# EAGLE design schematic (EAGLE 9.0.0)
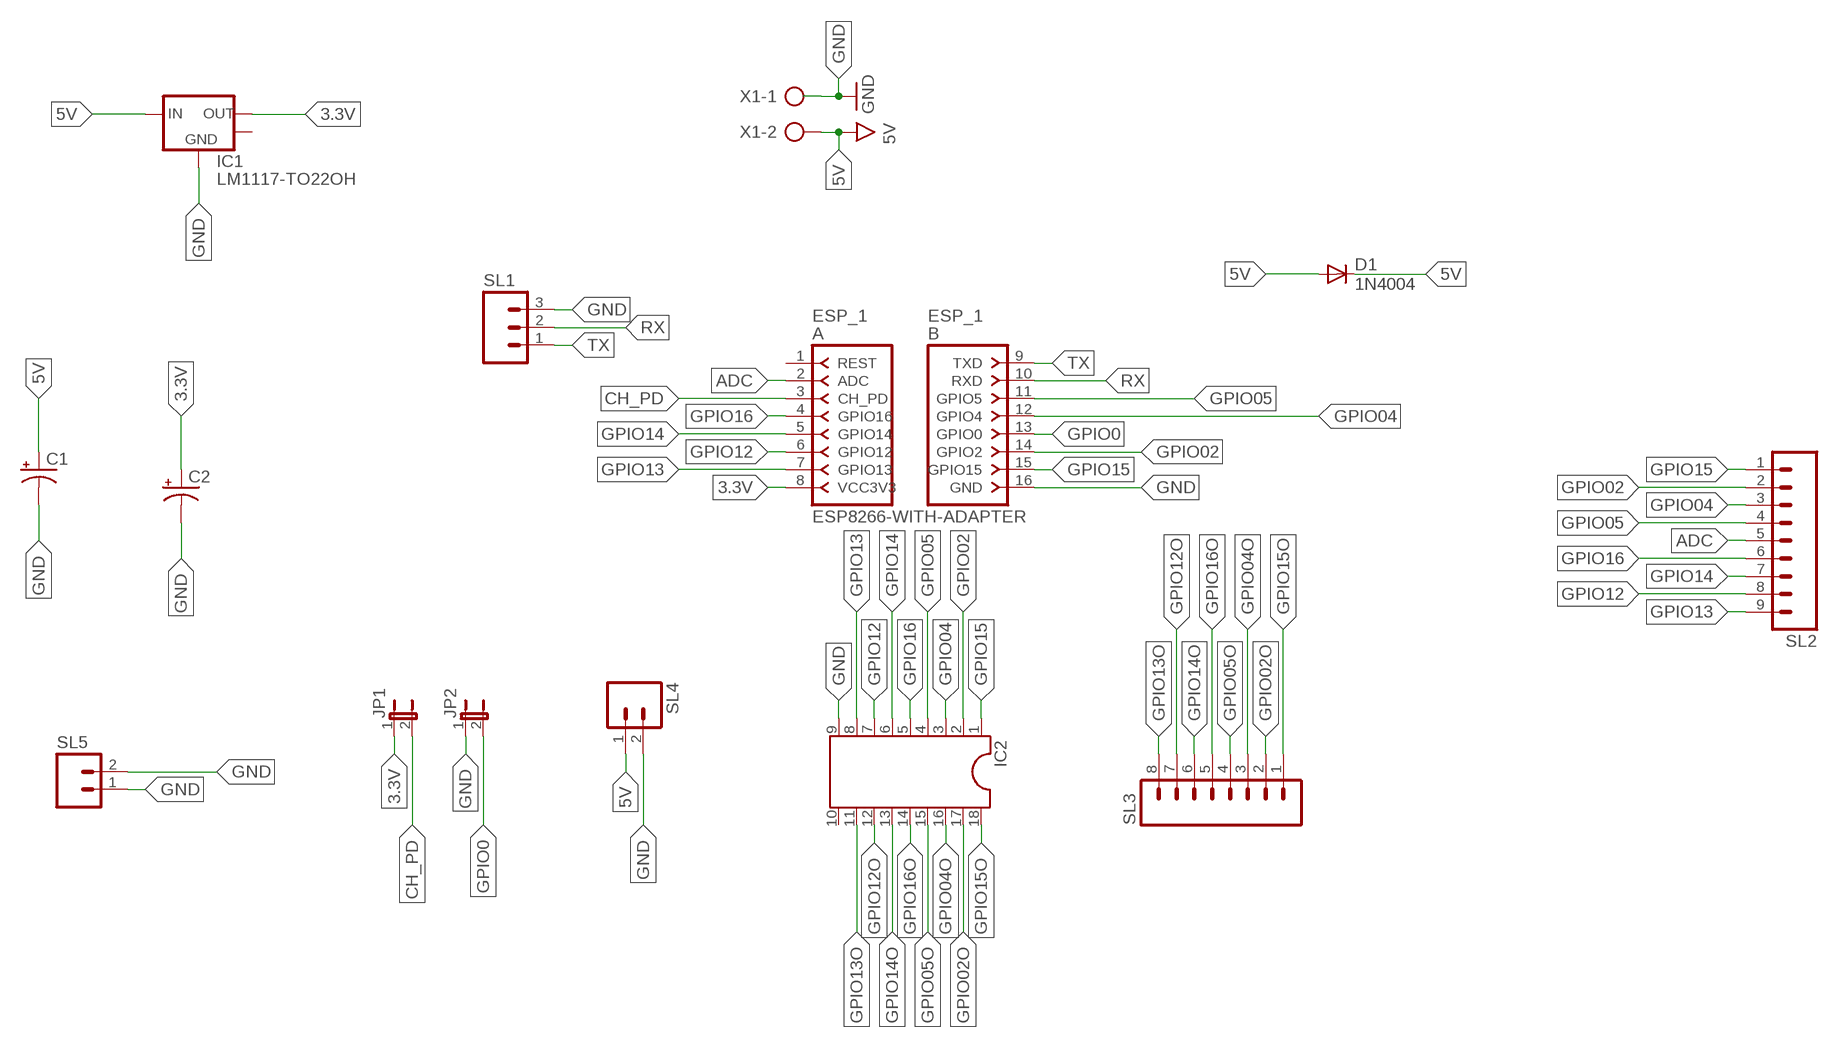
[diagram p0: schematic, sheet 1]

## Parts
C1  CPOL-USE2-4  [E2-4]
C2  CPOL-USE2-4  [E2-4]
D1  1N4004  [DO41-10]
ESP_1  ESP8266-WITH-ADAPTER  [ESP8266-ADAPTER]
IC1  LM1117-TO22OH  [TO220L1]
IC2  DIL18  [DIL18]
JP1  JP1E  [JP1]
JP2  JP1E  [JP1]
SL1  M03  [03P]
SL2  M09  [09P]
SL3  M08  [08P]
SL4  M02  [02P]
SL5  M02  [02P]
X1  AK500/2-H  [AK500/2-H]

## Nets
3.3V: C2.+ ESP_1.8(VCC3V3) IC1.2(VOUT) JP1.1
5V: C1.+ D1.A D1.C IC1.3(VIN) SL4.1 X1.2
ADC: ESP_1.2(ADC) SL2.5
CH_PD: ESP_1.3(CH_PD) JP1.2
GND: C1.- C2.- ESP_1.16(GND) IC1.1(GND) IC2.9 JP2.1 SL1.3 SL4.2 SL5.1 SL5.2 X1.1
GPIO0: ESP_1.13(GPIO0) JP2.2
GPIO02: ESP_1.14(GPIO2) IC2.2 SL2.2
GPIO02O: IC2.17 SL3.2
GPIO04: ESP_1.12(GPIO4) IC2.3 SL2.3
GPIO04O: IC2.16 SL3.3
GPIO05: ESP_1.11(GPIO5) IC2.4 SL2.4
GPIO05O: IC2.15 SL3.4
GPIO12: ESP_1.6(GPIO12) IC2.7 SL2.8
GPIO12O: IC2.12 SL3.7
GPIO13: ESP_1.7(GPIO13) IC2.8 SL2.9
GPIO13O: IC2.11 SL3.8
GPIO14: ESP_1.5(GPIO14) IC2.6 SL2.7
GPIO14O: IC2.13 SL3.6
GPIO15: ESP_1.15(GPIO15) IC2.1 SL2.1
GPIO15O: IC2.18 SL3.1
GPIO16: ESP_1.4(GPIO16) IC2.5 SL2.6
GPIO16O: IC2.14 SL3.5
RX: ESP_1.10(RXD) SL1.2
TX: ESP_1.9(TXD) SL1.1
Unconnected: ESP_1.1(REST) IC1.4(HEATSINK) IC2.10

## Library data of the parts
C1 C2 = adafruit:CPOL-US: POLARIZED CAPACITOR, American symbol
D1 = adafruit:1N4004: DIODE General purpose 1N400x type rectifier (With bigger pads) http://www.ladyada.net/library/pcb/eaglelibrary.html
ESP_1 = esp8266_with_adapter:ESP8266-WITH-ADAPTER: ESP8266 Adapter for ESP8266-03, ESP8266-04, ESP8266-07, ESP8266-08, ESP8266-12 and similar. (c) by Bartosz Batorek obi--wan@wp.pl
IC1 = bt_regulator:LM1117: LDO Voltage Regulator NCP1117 series are low dropout positive voltage regulators that are capable of providing an output current that is in excess of 1.0 A with a maximum dropout voltage of 1.2 V at 800 mA over temperature. This series contains nine fixed output voltages of 1.5 V, 1.8 V, 1.9 V, 2.0 V, 2.5 V, 2.85 V, 3.3 V, 5.0 V, and 12 V that have no minimum load requirement to maintain regulation. Also included is an adjustable output version that can be programmed from 1.25 V to 18.8 V with two external resistors. datasheet.pdf <http://www.onsemi.com/pub_link/Collateral/NCP1117-D.PDF> LM1117-N is a series of low dropout voltage regulators of 1.2V at 800mA of load current. It has the same pin-out as Texas Instruments' industry standard LM317. The LM1117-N is available in an adjustable version, available in five fixed voltages, 1.8V, 2.5V, 2.85V, 3.3V, and 5V. The LM1117-N offers current limiting and thermal shutdown. Its circuit includes a zener trimmed to within ±1%. datasheet.pdf <http://www.ti.com/lit/ds/symlink/lm1117-n.pdf>
IC2 = ic-package:DIL18: Dual In Line / Socket
JP1 JP2 = jumper:JP1E: JUMPER
SL1 = con-amp-quick:M03: AMP QUICK CONNECTOR; OC_FARNELL: unknown; OC_NEWARK: unknown
SL2 = con-amp-quick:M09: AMP QUICK CONNECTOR; OC_FARNELL: unknown; OC_NEWARK: unknown
SL3 = con-amp-quick:M08: AMP QUICK CONNECTOR; OC_FARNELL: unknown; OC_NEWARK: unknown
SL4 SL5 = con-amp-quick:M02: AMP QUICK CONNECTOR; OC_FARNELL: unknown; OC_NEWARK: unknown
X1 = con-ptr500:AK500/2-H: CONNECTOR Aug. 2004 / PTR Meßtechnik: Die Bezeichnung der Serie AK505 wurde geändert. Es handelt sich hierbei um AK500 in horizontaler Ausführung.; OC_FARNELL: unknown; OC_NEWARK: unknown

## Board
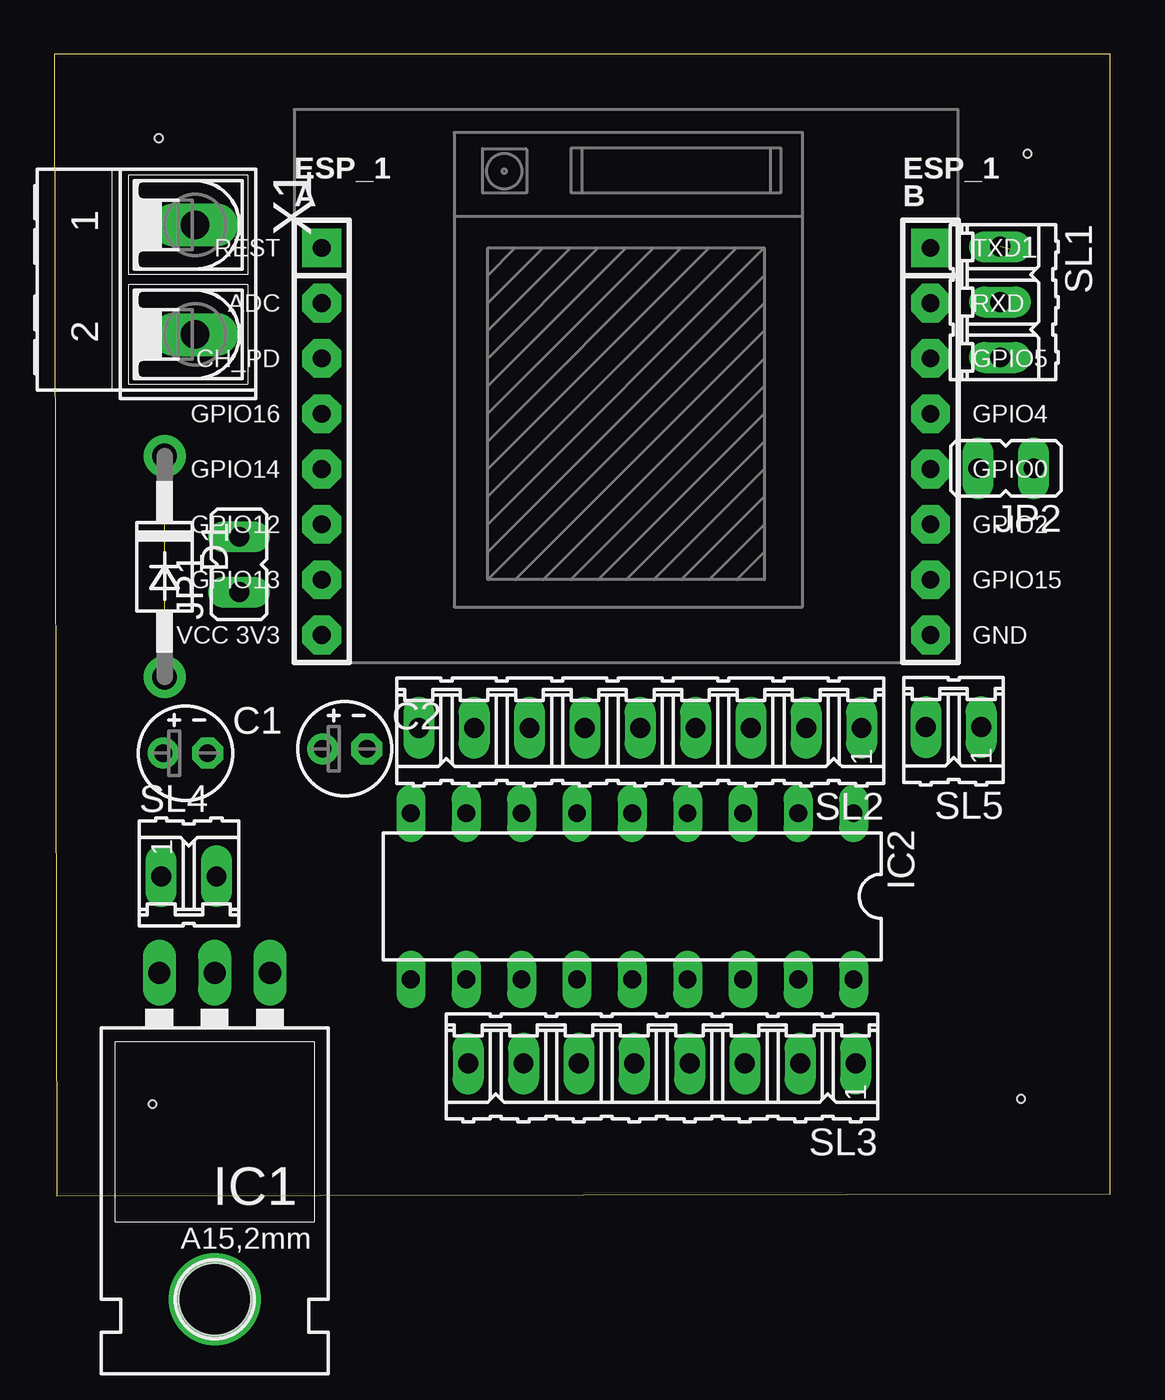
[diagram p1: board, top side]
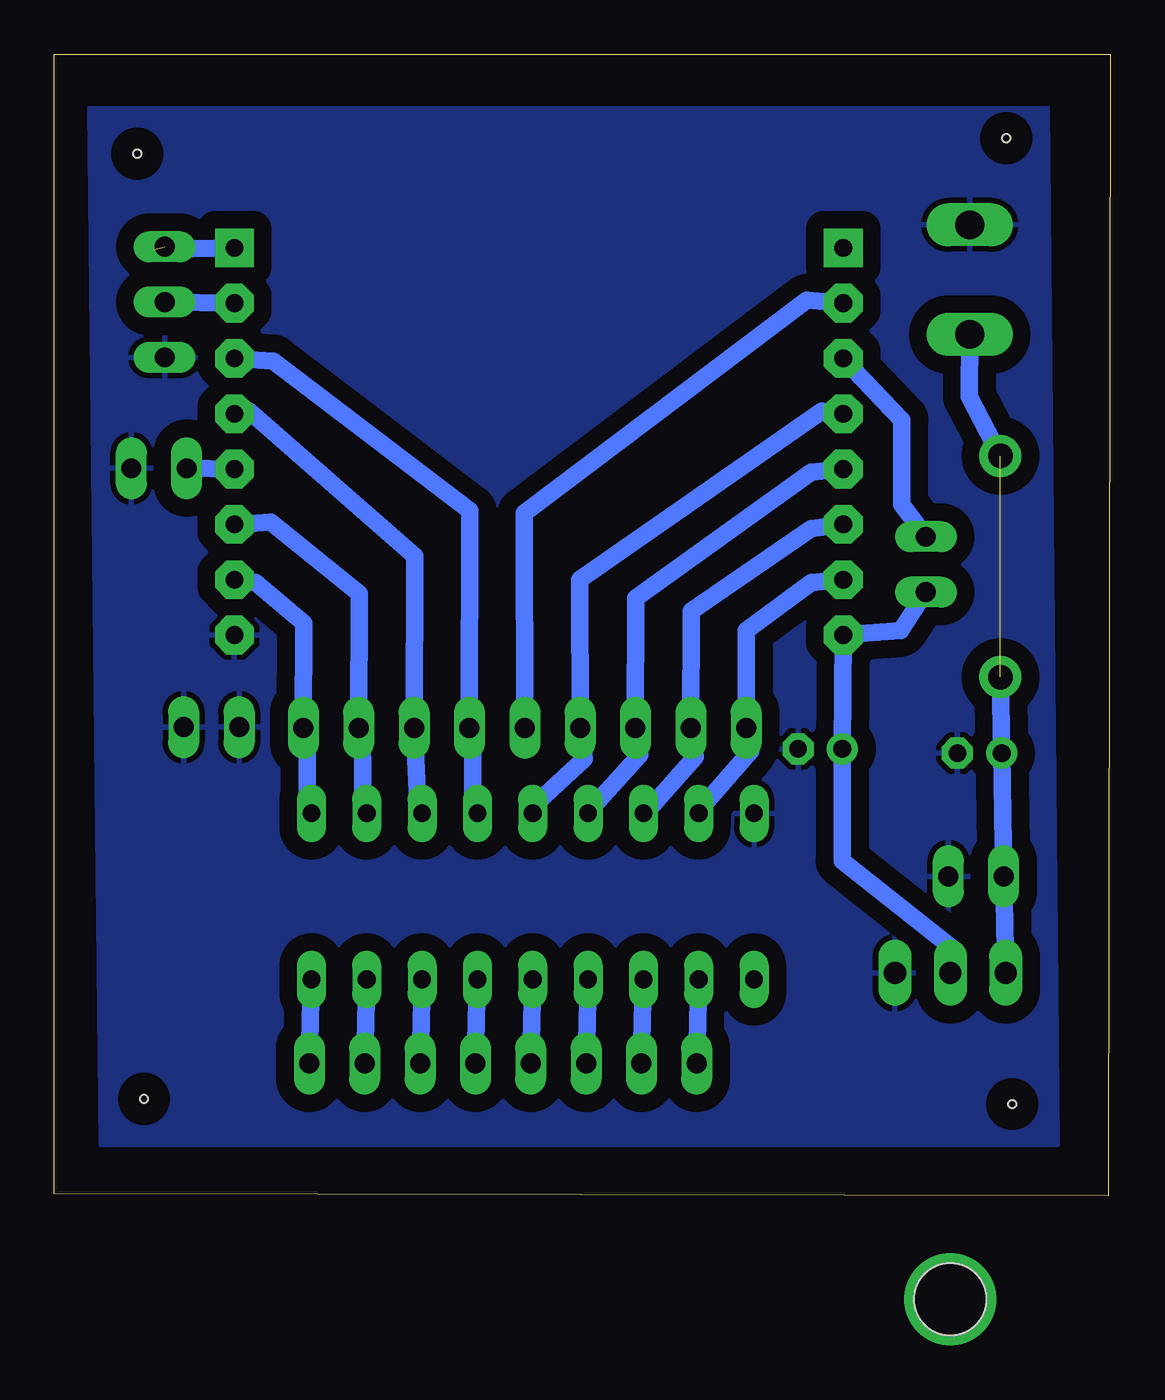
[diagram p2: board, bottom side, seen from below]

Size 48.47 x 52.41 mm. Coordinates in mm from the lower left corner, seen from the top.
Outline: 0.09,0 48.47,0.09 48.47,52.41 0,52.41 0.09,0
Copper layers (1*16): Top 0.035mm / dielectric 1.5mm / Bottom 0.035mm
Design rules "default": minimum track width 6mil, minimum drill 0.35mm, track to track 6mil, track to pad 6mil, pad to pad 6mil, via to via 6mil, smd to smd 6mil, copper to edge 40mil, drill to drill 6mil, minimum pad ring 10mil, minimum via ring 8mil, stop-mask expansion 4mil, vias tented up to drill 0mil, thermal gap 10mil
Holes 0.35 mm at 4.79,48.57 44.67,47.85 44.36,4.45 4.5,4.21

### Footprints (pad centres in the part's own frame; a part is rotated, then mirrored left to right if it is on the bottom)
E2-4 = drill 0.813 pad 1.422: + -1.016,0 | drill 0.813 pad 1.422 octagon: - 1.016,0
DO41-10 = drill 1.118 pad 1.93: A 5.08,0; C -5.08,0
ESP8266-ADAPTER = drill 0.813 pad 1.778 square: 1 -13.97,8.89; 9 13.97,8.89 | drill 0.813 pad 1.778 octagon: 2 -13.97,6.35; 3 -13.97,3.81; 4 -13.97,1.27; 5 -13.97,-1.27; 6 -13.97,-3.81; 7 -13.97,-6.35; 8 -13.97,-8.89; 10 13.97,6.35; 11 13.97,3.81; 12 13.97,1.27; 13 13.97,-1.27; 14 13.97,-3.81; 15 13.97,-6.35; 16 13.97,-8.89
TO220L1 = drill 1.016 long: 1 -2.54,-3.81; 2 0,-3.81; 3 2.54,-3.81 | drill 3.2: 4 0,11.176 | hole 3.302: 0,11.176
DIL18 = drill 0.813 long: 1 -10.16,-3.81; 2 -7.62,-3.81; 3 -5.08,-3.81; 4 -2.54,-3.81; 5 0,-3.81; 6 2.54,-3.81; 7 5.08,-3.81; 8 7.62,-3.81; 9 10.16,-3.81; 10 10.16,3.81; 11 7.62,3.81; 12 5.08,3.81; 13 2.54,3.81; 14 0,3.81; 15 -2.54,3.81; 16 -5.08,3.81; 17 -7.62,3.81; 18 -10.16,3.81
JP1 = drill 0.914 long: 1 0,-1.27; 2 0,1.27
03P = drill 0.914 long: 1 -2.54,0; 2 0,0; 3 2.54,0
09P = drill 0.914 long: 1 -10.16,0; 2 -7.62,0; 3 -5.08,0; 4 -2.54,0; 5 0,0; 6 2.54,0; 7 5.08,0; 8 7.62,0; 9 10.16,0
08P = drill 0.914 long: 1 -8.89,0; 2 -6.35,0; 3 -3.81,0; 4 -1.27,0; 5 1.27,0; 6 3.81,0; 7 6.35,0; 8 8.89,0
02P = drill 0.914 long: 1 -1.27,0; 2 1.27,0
AK500/2-H = drill 1.321 long: 1 -2.515,0; 2 2.515,0

### Placement (x,y rotation side)
C1  6.01,20.32 0 top
C2  13.32,20.52 0 top
D1  5.05,28.89 270 top
ESP_1  26.24,34.64 0 top
IC1  7.35,6.43 180 top
IC2  26.52,13.75 180 top
JP1  8.48,28.99 0 top
JP2  43.67,33.4 90 top
SL1  43.41,41.04 270 top
SL2  26.88,21.48 180 top
SL3  27.88,6.07 180 top
SL4  6.17,14.67 0 top
SL5  41.27,21.52 180 top
X1  6.46,42.07 270 top

### Tracks (layer width: path | path; a pad name or v marks a point on that pad's centre or on a via)
3.3V
  Bottom 0.813: JP1.1 9.63,25.97 12.13,25.77 ESP_1.8 C2.+ 12.32,15.38 7.36,11.46 IC1.2
5V  (1 unrouted)
  Bottom 0.813: X1.2 6.47,36.69 D1.C | D1.A C1.+ SL4.1 IC1.3
ADC
  Bottom 0.813: ESP_1.2 13.94,41.12 26.91,31.35 SL2.5
CH_PD
  Bottom 0.813: JP1.2 9.57,31.74 9.57,35.63 ESP_1.3
GND
  pour Bottom (isolate 0.813): 2.86,49.98 2.39,2.33 46.38,2.32 46.9,49.97
GPIO0
  Bottom 0.813: ESP_1.13 JP2.2
GPIO02
  Bottom 0.813: ESP_1.14 38.53,30.95 34.48,27.66 SL2.2 34.31,20.06 34.31,18.26 IC2.2
GPIO02O
  Bottom 0.813: IC2.17 SL3.2
GPIO04
  Bottom 0.813: ESP_1.12 39.53,36.03 31.94,29.37 SL2.3 31.81,18.59 31.67,17.93 IC2.3
GPIO04O
  Bottom 0.813: IC2.16 SL3.3
GPIO05
  Bottom 0.813: ESP_1.11 38.44,38.33 29.4,31.46 SL2.4 29.26,20.25 29.26,18.45 IC2.4
GPIO05O
  Bottom 0.813: IC2.15 SL3.4
GPIO12
  Bottom 0.813: ESP_1.6 13.74,30.65 19.24,26.86 SL2.8 19.07,20.15 21.19,17.74 IC2.7
GPIO12O
  Bottom 0.813: IC2.12 SL3.7
GPIO13
  Bottom 0.813: ESP_1.7 13.74,28.16 16.71,25.96 SL2.9 16.52,20.44 18.64,17.98 IC2.8
GPIO13O
  Bottom 0.813: SL3.8 IC2.11
GPIO14
  Bottom 0.813: ESP_1.5 13.74,33.24 21.79,27.46 SL2.7 21.61,20.25 23.74,17.89 IC2.6
GPIO14O
  Bottom 0.813: IC2.13 SL3.6
GPIO15
  Bottom 0.813: ESP_1.15 39.23,28.16 37.03,26.31 SL2.1 36.86,20.2 36.86,17.84 IC2.1
GPIO15O
  Bottom 0.813: IC2.18 SL3.1
GPIO16
  Bottom 0.813: ESP_1.4 13.24,36.03 24.36,28.3 SL2.6 24.16,20.06 26.29,18.07 IC2.5
GPIO16O
  Bottom 0.813: IC2.14 SL3.5
RX
  Bottom 0.813: ESP_1.10 SL1.2
TX  (1 unrouted)
  Bottom 0.813: ESP_1.9 43.92,43.46